# EAGLE design LampV1 (EAGLE 8.2.2)
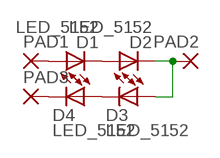
[diagram p0: schematic, sheet 1]

## Parts
D1  LED_5152  [LED-5152]
D2  LED_5152  [LED-5152]
D3  LED_5152  [LED-5152]
D4  LED_5152  [LED-5152]
PAD1  2,54/1,1  [2,54/1,1]
PAD2  2,54/1,1  [2,54/1,1]
PAD3  2,54/1,1  [2,54/1,1]

## Nets
1: D1.A PAD1.1(P)
2: D1.C D2.A
3: D2.C D3.A PAD2.1(P)
4: D3.C D4.A
5: D4.C PAD3.1(P)

## Library data of the parts
D1-D4 = Namenlos:LED_
PAD1-PAD3 = wirepad:2,54/1,1: THROUGH-HOLE PAD

## Board
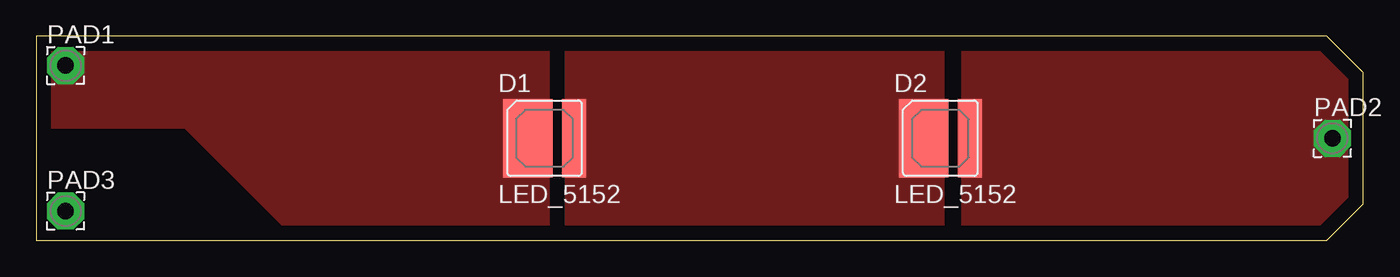
[diagram p1: board, top side]
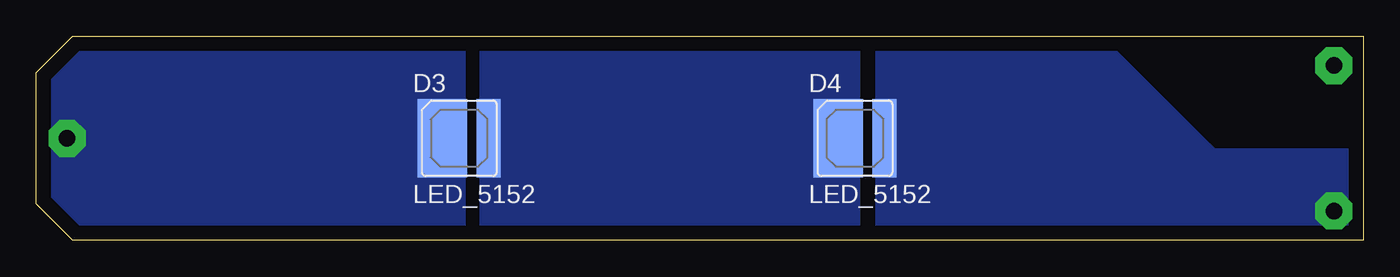
[diagram p2: board, bottom side, seen from below]

Size 91 x 14 mm. Coordinates in mm from the lower left corner, seen from the top.
Outline: 0,0 88.5,0 91,2.5 91,11.5 88.5,14 0,14 0,0
Copper layers (1*16): Top 0.035mm / dielectric 1.5mm / Bottom 0.035mm
Design rules "default": minimum track width 6mil, minimum drill 0.35mm, track to track 6mil, track to pad 6mil, pad to pad 6mil, via to via 6mil, smd to smd 6mil, copper to edge 40mil, drill to drill 6mil, minimum pad ring 10mil, minimum via ring 8mil, stop-mask expansion 4mil, vias tented up to drill 0mil, thermal gap 10mil

### Footprints (pad centres in the part's own frame; a part is rotated, then mirrored left to right if it is on the bottom)
LED-5152 = smd 3.4 x 5.4: A -1.15,0 | smd 1.65 x 5.4: C 2.025,0
2,54/1,1 = drill 1.118 pad 2.54 octagon: 1 0,0

### Placement (x,y rotation side)
D1  34.85,7 0 top
D2  62,7 0 top
D3  62,7 0 bottom
D4  34.85,7 0 bottom
PAD1  2,12 0 top
PAD2  88.9,7 0 top
PAD3  2,2 0 top

### Tracks (layer width: path | path; a pad name or v marks a point on that pad's centre or on a via)
1
  pour Top (no thermals): 0,7.75 10.16,7.75 17.91,0 35.18,0 35.18,13.97 0,13.97
2
  pour Top (no thermals): 36.32,0 36.32,13.97 62.23,13.97 62.23,0 36.83,0
3
  pour Top (no thermals): 63.5,0 63.5,13.97 88.43,13.97 90.93,11.47 90.93,2.5 88.43,0
  pour Bottom (no thermals): 61.59,0 61.59,13.97 88.39,13.97 90.93,11.43 90.93,2.54 88.39,0
4
  pour Bottom (no thermals): 34.54,0 34.54,13.97 60.58,13.97 60.58,0
5
  pour Bottom (no thermals): 0,6.22 10.16,6.22 17.91,13.97 33.4,13.97 33.4,0 0,0